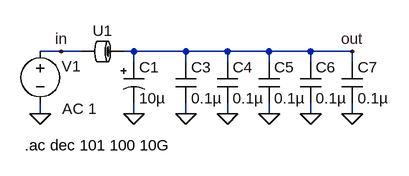
[diagram p0: schematic 01_500KHz_filter.asc]
01_500KHz_filter.asc, the LTspice schematic file:
Version 4
SHEET 1 880 680
WIRE 160 112 128 112
WIRE 192 112 160 112
WIRE 272 112 256 112
WIRE 352 112 272 112
WIRE 416 112 352 112
WIRE 480 112 416 112
WIRE 544 112 480 112
WIRE 608 112 544 112
WIRE 272 128 272 112
WIRE 352 128 352 112
WIRE 416 128 416 112
WIRE 480 128 480 112
WIRE 544 128 544 112
WIRE 608 128 608 112
WIRE 128 208 128 192
WIRE 272 208 272 192
WIRE 352 208 352 192
WIRE 416 208 416 192
WIRE 480 208 480 192
WIRE 544 208 544 192
WIRE 608 208 608 192
FLAG 272 208 0
FLAG 128 208 0
FLAG 608 112 out
FLAG 160 112 in
FLAG 352 208 0
FLAG 416 208 0
FLAG 480 208 0
FLAG 544 208 0
FLAG 608 208 0
SYMBOL BLM18HG471SN1 224 112 R90
WINDOW 0 -16 0 VBottom 2
SYMATTR InstName U1
SYMBOL polcap 256 128 R0
WINDOW 3 24 56 Left 2
SYMATTR InstName C1
SYMATTR Value 10µ
SYMATTR Description Capacitor
SYMATTR Type cap
SYMATTR SpiceLine V=10 Irms=1.18322 Rser=0.08 Lser=0 mfg="KEMET" pn="T525A106M010ATE080" type="Tantalum"
SYMBOL voltage 128 96 R0
WINDOW 0 33 39 Left 2
WINDOW 3 34 76 Left 2
WINDOW 123 34 104 Left 2
WINDOW 39 0 0 Left 0
SYMATTR InstName V1
SYMATTR Value ""
SYMATTR Value2 AC 1
SYMBOL cap 336 128 R0
SYMATTR InstName C3
SYMATTR Value 0.1µ
SYMATTR SpiceLine V=50 Irms=728m Rser=0.14361 Lser=0 mfg="KEMET" pn="C0603C104K5RAC" type="X7R"
SYMBOL cap 400 128 R0
SYMATTR InstName C4
SYMATTR Value 0.1µ
SYMATTR SpiceLine V=50 Irms=728m Rser=0.14361 Lser=0 mfg="KEMET" pn="C0603C104K5RAC" type="X7R"
SYMBOL cap 464 128 R0
SYMATTR InstName C5
SYMATTR Value 0.1µ
SYMATTR SpiceLine V=50 Irms=728m Rser=0.14361 Lser=0 mfg="KEMET" pn="C0603C104K5RAC" type="X7R"
SYMBOL cap 528 128 R0
SYMATTR InstName C6
SYMATTR Value 0.1µ
SYMATTR SpiceLine V=50 Irms=728m Rser=0.14361 Lser=0 mfg="KEMET" pn="C0603C104K5RAC" type="X7R"
SYMBOL cap 592 128 R0
SYMATTR InstName C7
SYMATTR Value 0.1µ
SYMATTR SpiceLine V=50 Irms=728m Rser=0.14361 Lser=0 mfg="KEMET" pn="C0603C104K5RAC" type="X7R"
TEXT 104 256 Left 2 !.ac dec 101 100 10G

The netlist it stands for:
* 01_500KHz_filter.asc
XU1 out in BLM18HG471SN1  ; pins A B
C1 out 0 10µ V=10 Irms=1.18322 Rser=0.08 Lser=0 mfg="KEMET" pn="T525A106M010ATE080" type="Tantalum"
V1 in 0 AC 1
C3 out 0 0.1µ V=50 Irms=728m Rser=0.14361 Lser=0 mfg="KEMET" pn="C0603C104K5RAC" type="X7R"
C4 out 0 0.1µ V=50 Irms=728m Rser=0.14361 Lser=0 mfg="KEMET" pn="C0603C104K5RAC" type="X7R"
C5 out 0 0.1µ V=50 Irms=728m Rser=0.14361 Lser=0 mfg="KEMET" pn="C0603C104K5RAC" type="X7R"
C6 out 0 0.1µ V=50 Irms=728m Rser=0.14361 Lser=0 mfg="KEMET" pn="C0603C104K5RAC" type="X7R"
C7 out 0 0.1µ V=50 Irms=728m Rser=0.14361 Lser=0 mfg="KEMET" pn="C0603C104K5RAC" type="X7R"
.ac dec 101 100 10G
.lib BLM18HG471SN1.mod
.backanno
.end